# Altium schematic sheet clock.SchDoc: FastIC+ readout
size 297 x 209 mm; Organization: CERN; SheetNumber: 3; SheetTotal: 6; Projet: Fast Timing; ModifiedDate: -
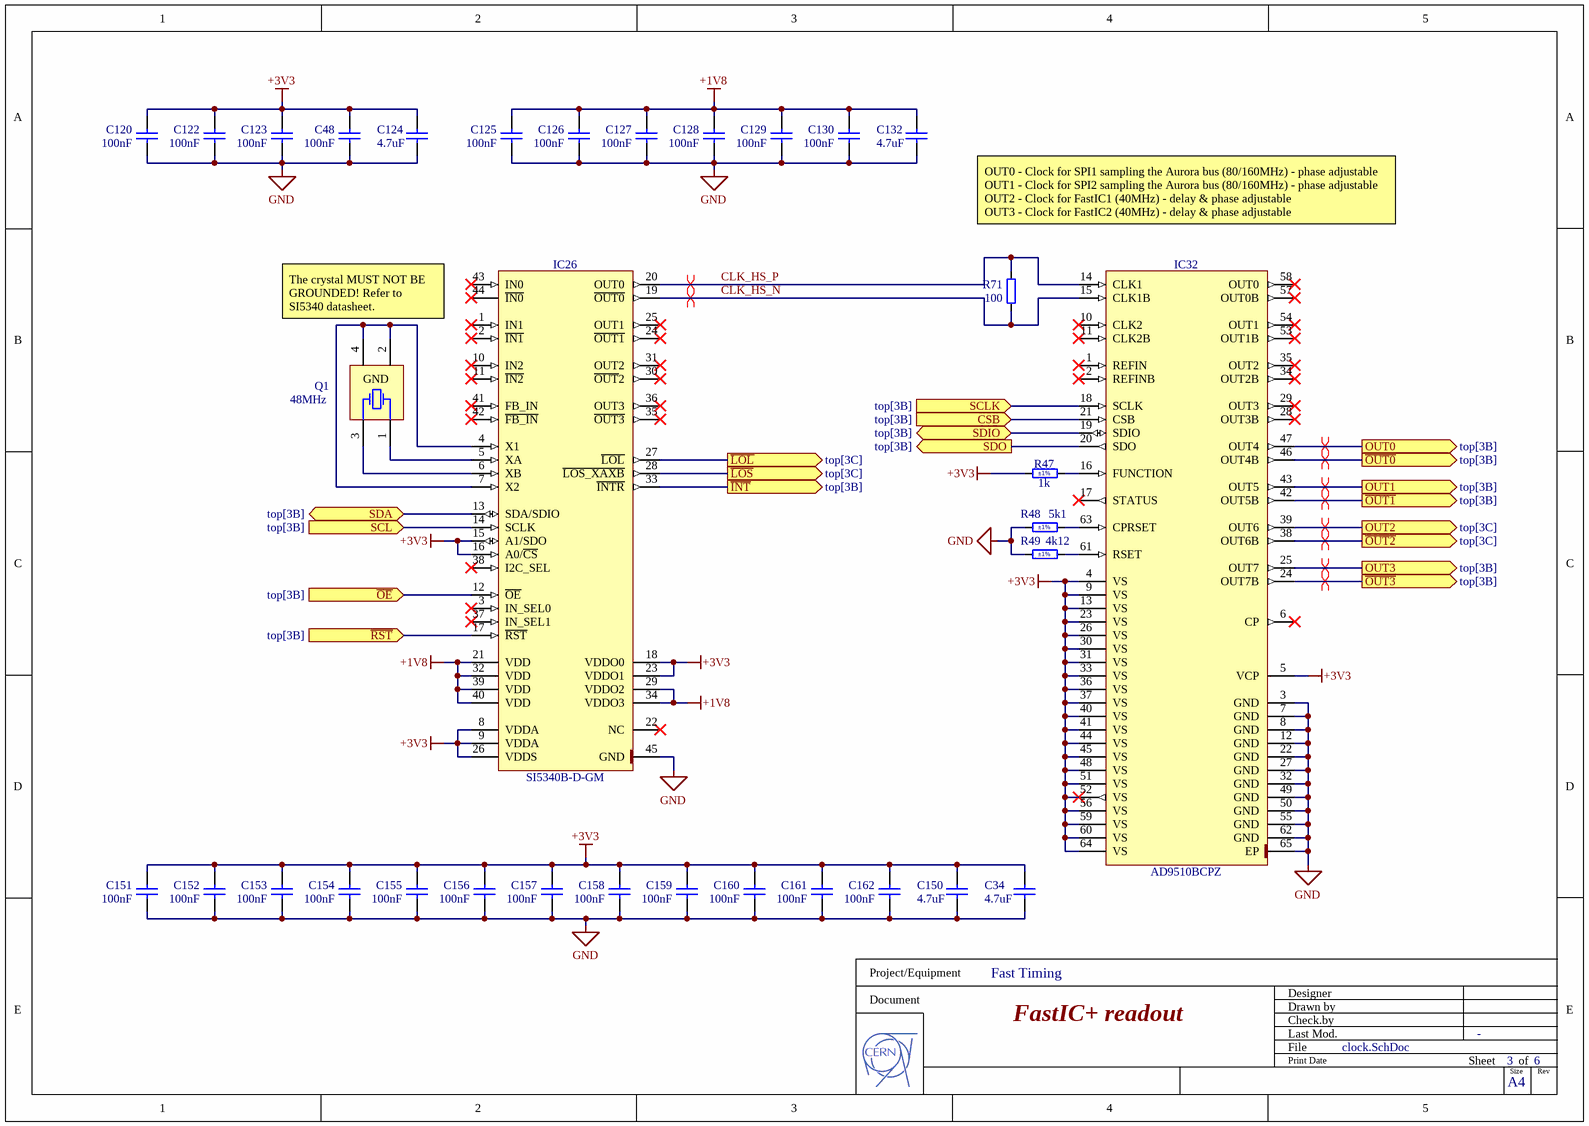
[diagram p0: clock.SchDoc]

## Parts
C34  4.7uF  [CAPC1608X87N]
C48  100nF  [CAPC1005X55N]
C120  100nF  [CAPC1005X55N]
C122  100nF  [CAPC1005X55N]
C123  100nF  [CAPC1005X55N]
C124  4.7uF  [CAPC1608X87N]
C125  100nF  [CAPC1005X55N]
C126  100nF  [CAPC1005X55N]
C127  100nF  [CAPC1005X55N]
C128  100nF  [CAPC1005X55N]
C129  100nF  [CAPC1005X55N]
C130  100nF  [CAPC1005X55N]
C132  4.7uF  [CAPC1608X87N]
C150  4.7uF  [CAPC1608X87N]
C151  100nF  [CAPC1005X55N]
C152  100nF  [CAPC1005X55N]
C153  100nF  [CAPC1005X55N]
C154  100nF  [CAPC1005X55N]
C155  100nF  [CAPC1005X55N]
C156  100nF  [CAPC1005X55N]
C157  100nF  [CAPC1005X55N]
C158  100nF  [CAPC1005X55N]
C159  100nF  [CAPC1005X55N]
C160  100nF  [CAPC1005X55N]
C161  100nF  [CAPC1005X55N]
C162  100nF  [CAPC1005X55N]
IC26  SI5340B-D-GM  [QFN50P700X700X90-45N-S530]
IC32  AD9510BCPZ  [QFN50P900X900X100-65N-S485]
Q1  48MHz  [XTAL_KYOCERA_CX3225SB]
R47  1k  Tolerance: ±1%  [RESC1005X40N]
R48  5k1  Tolerance: ±1%  [RESC1005X40N]
R49  4k12  Tolerance: ±1%  [RESC1005X40N]
R71  100  [RESC1005X40N]

## Ports
CSB (in, see top[3B]), OUT0 (out, see top[3B]), OUT1 (out, see top[3B]), OUT2 (out, see top[3C]), OUT3 (out, see top[3B]), SCL (in, see top[3B]), SCLK (in, see top[3B]), SDA (bidir, see top[3B]), SDIO (bidir, see top[3B]), SDO (out, see top[3B]), ~{INT} (out, see top[3B]), ~{LOL} (out, see top[3C]), ~{LOS} (out, see top[3C]), ~{OE} (in, see top[3B]), ~{OUT0} (out, see top[3B]), ~{OUT1} (out, see top[3B]), ~{OUT2} (out, see top[3C]), ~{OUT3} (out, see top[3B]), ~{RST} (in, see top[3B])

## Nets
+1V8: C125.2 C126.2 C127.2 C128.2 C129.2 C130.2 C132.1 IC26.21(VDD) IC26.29(VDDO2) IC26.32(VDD) IC26.34(VDDO3) IC26.39(VDD) IC26.40(VDD)
+3V3: C34.1 C48.2 C120.2 C122.2 C123.2 C124.1 C150.1 C151.2 C152.2 C153.2 C154.2 C155.2 C156.2 C157.2 C158.2 C159.2 C160.2 C161.2 C162.2 IC26.8(VDDA) IC26.9(VDDA) IC26.15(A1/SDO) IC26.16(A0/~{CS}) IC26.18(VDDO0) IC26.23(VDDO1) IC26.26(VDDS) IC32.4(VS) IC32.5(VCP) IC32.9(VS) IC32.13(VS) IC32.23(VS) IC32.26(VS) IC32.30(VS) IC32.31(VS) IC32.33(VS) IC32.36(VS) IC32.37(VS) IC32.40(VS) IC32.41(VS) IC32.44(VS) IC32.45(VS) IC32.48(VS) IC32.51(VS) IC32.52(VS) IC32.56(VS) IC32.59(VS) IC32.60(VS) IC32.64(VS) R47.1
GND: C34.2 C48.1 C120.1 C122.1 C123.1 C124.2 C125.1 C126.1 C127.1 C128.1 C129.1 C130.1 C132.2 C150.2 C151.1 C152.1 C153.1 C154.1 C155.1 C156.1 C157.1 C158.1 C159.1 C160.1 C161.1 C162.1 IC26.45(GND) IC32.3(GND) IC32.7(GND) IC32.8(GND) IC32.12(GND) IC32.22(GND) IC32.27(GND) IC32.32(GND) IC32.49(GND) IC32.50(GND) IC32.55(GND) IC32.62(GND) IC32.65(EP) R48.1 R49.1
CLK_HS_N: IC26.19(~{OUT0}) IC32.15(CLK1B) R71.2
CLK_HS_P: IC26.20(OUT0) IC32.14(CLK1) R71.1
CSB: IC32.21(CSB) ; port CSB
~{INT}: IC26.33(~{INTR}) ; port ~{INT}
~{LOL}: IC26.27(~{LOL}) ; port ~{LOL}
~{LOS}: IC26.28(~{LOS_XAXB}) ; port ~{LOS}
~{OE}: IC26.12(~{OE}) ; port ~{OE}
~{OUT0}: IC32.46(OUT4B) ; port ~{OUT0}
~{OUT1}: IC32.42(OUT5B) ; port ~{OUT1}
~{OUT2}: IC32.38(OUT6B) ; port ~{OUT2}
~{OUT3}: IC32.24(OUT7B) ; port ~{OUT3}
OUT0: IC32.47(OUT4) ; port OUT0
OUT1: IC32.43(OUT5) ; port OUT1
OUT2: IC32.39(OUT6) ; port OUT2
OUT3: IC32.25(OUT7) ; port OUT3
~{RST}: IC26.17(~{RST}) ; port ~{RST}
SCL: IC26.14(SCLK) ; port SCL
SCLK: IC32.18(SCLK) ; port SCLK
SDA: IC26.13(SDA/SDIO) ; port SDA
SDIO: IC32.19(SDIO) ; port SDIO
SDO: IC32.20(SDO) ; port SDO
NetIC26_4: IC26.4(X1) IC26.7(X2) Q1.2(GND) Q1.4(GND)
NetIC26_5: IC26.5(XA) Q1.1(X)
NetIC26_6: IC26.6(XB) Q1.3(X)
NetIC32_16: IC32.16(FUNCTION) R47.2
NetIC32_61: IC32.61(RSET) R49.2
NetIC32_63: IC32.63(CPRSET) R48.2

Not connected (* = marked no-connect by the designer): IC26 1(IN1)* 2(~{IN1})* 3(IN_SEL0)* 10(IN2)* 11(~{IN2})* 22(NC)* 24(~{OUT1})* 25(OUT1)* 30(~{OUT}2)* 31(OUT2)* 35(~{OUT3})* 36(OUT3)* 37(IN_SEL1)* 38(I2C_SEL)* 41(FB_IN)* 42(~{FB_IN})* 43(IN0)* 44(~{IN0})*; IC32 1(REFIN)* 2(REFINB)* 6(CP)* 10(CLK2)* 11(CLK2B)* 17(STATUS)* 28(OUT3B)* 29(OUT3)* 34(OUT2B)* 35(OUT2)* 53(OUT1B)* 54(OUT1)* 57(OUT0B)* 58(OUT0)*

## Layout directives
differential pair: CLK_HS_N, CLK_HS_P, OUT0, OUT1, OUT2, OUT3, ~{OUT0}, ~{OUT1}, ~{OUT2}, ~{OUT3}

## Notes on the sheet
- OUT0 - Clock for SPI1 sampling the Aurora bus (80/160MHz) - phase adjustable
  OUT1 - Clock for SPI2 sampling the Aurora bus (80/160MHz) - phase adjustable
  OUT2 - Clock for FastIC1 (40MHz) - delay & phase adjustable
  OUT3 - Clock for FastIC2 (40MHz) - delay & phase adjustable
- The crystal MUST NOT BE GROUNDED! Refer to SI5340 datasheet.
- Project/Equipment
- Document
- Designer
- Drawn by
- Check.by
- File
- Last Mod.
- Print Date
- Sheet
- Size
- A4
- of
- Rev

## Library data of the parts
C34 C124 C132 C150 = CC0603_4.7UF_6.3V_10%_X5R: Non-polarised capacitor; Part Description: SMD Multilayer Chip Ceramic Capacitor; Manufacturer: GENERIC; Manufacturer1 Part Number: 225520613672; Voltage: 6.3V; TC: X5R; Tolerance: ±10%; Part Number: CC0603_4.7UF_6.3V_10%_X5R; Component Kind: Standard; Component Type: Standard; Pin Count: 2; Value: 4.7uF; Status: Preferred; Manufacturer Part Number: CC0603_4.7UF_6.3V_10%_X5R; Case: 0603; Mounted: Yes; Socket: No; SMD: Yes; Sense: No; Manufacturer1 Example: PHYCOMP; Manufacturer1 ComponentHeight: 0.87mm; HelpURL: \\cern.ch\dfs\Applications\Altium\Datasheets\CC0805_X5R_PHYCOMP_HC.pdf; Author: CERN DEM JLC; CreateDate: 03/12/2007; LatestRevisionDate: 03/12/2007
C48 C120 C122 C123 C125-C130 C151-C162 = CC0402_100NF_16V_10%_X7R: Non-polarised capacitor; Part Description: SMD Multilayer Chip Ceramic Capacitor; Manufacturer: GENERIC; Manufacturer1 Part Number: GRM155R71C104KA88D; Voltage: 16V; TC: X7R; Tolerance: ±10%; Part Number: CC0402_100NF_16V_10%_X7R; Component Kind: Standard; Component Type: Standard; Pin Count: 2; Value: 100nF; Status: Not Recommended; Manufacturer Part Number: CC0402_100NF_16V_10%_X7R; Case: 0402; Mounted: Yes; Socket: No; SMD: Yes; Sense: No; Manufacturer1 Example: MURATA; Manufacturer1 ComponentHeight: 0.55mm; HelpURL: \\cern.ch\dfs\Applications\Altium\Datasheets\CC0402_X7R_MURATA_GRM.pdf; Author: CERN DEM JLC; CreateDate: 05/12/2013; LatestRevisionDate: 03/12/2007
IC26 = SI5340B-D-GM: Low-Jitter, 4-Output, Any-Frequency, Any-Output Clock Generator; Manufacturer: SILICON LABS; PressFit: No; Bonding: No; Part Number: SI5340B-D-GM; Component Kind: Standard; Component Type: Standard; Device: SI5340B-D-GM; PackageDescription: QFN, 0.50mm Pitch, Square; 44 Pin, 7.00mm L X 7.00mm W X 0.90mm H body (w/Thermal Tab 5.30 X 5.30mm), IPC Medium Density; Part Description: Low-Jitter, 4-Output, Any-Frequency, Any-Output Clock Generator; Manufacturer Part Number: SI5340B-D-GM; Pin Count: 45; Case: QFN44; Mounted: Yes; Socket: No; SMD: Yes; Sense: No; ComponentHeight: 0.9mm; Author: CERN DEM JLC; HelpURL: \\cern.ch\dfs\Applications\Altium\Datasheets\SI5340B-D-GM.pdf; CreateDate: 12/14/2017; LatestRevisionDate: 12/14/2017
IC32 = AD9510BCPZ: 1.2 GHz Clock Distribution IC, PLL Core, Dividers, Delay Adjust, Eight Outputs; Manufacturer: ANALOG DEVICES; PressFit: No; Bonding: No; Part Number: AD9510BCPZ; Component Kind: Standard; Component Type: Standard; Device: AD9510BCPZ; PackageDescription: QFN, 0.50mm Pitch, Square; 64 Pin, 9.00mm L X 9.00mm W X 1.00mm H body (w/Thermal Tab 4.85 X 4.85mm), IPC Medium Density; Part Description: 1.2 GHz Clock Distribution IC, PLL Core, Dividers, Delay Adjust, Eight Outputs; Manufacturer Part Number: AD9510BCP; Pin Count: 65; Case: QFN64; Mounted: Yes; Socket: No; SMD: Yes; Sense: No; ComponentHeight: 1mm; HelpURL: \\cern.ch\dfs\Applications\Altium\Datasheets\AD9510BCPZ.pdf; Author: CERN DEM JLC; CreateDate: 10/9/2012; LatestRevisionDate: 3/29/2022
Q1 = XTAL_48MHZ_KYOCERA_CX3225SB48000D0FPJC1: Crystal 4 pins 1=XTAL Control 2=GND3=XTAL 4=GND; Part Description: Tolerance: ±10ppm, Stability: ±15ppm, 8pF, -40°C to +85°C, Surface Mount Crystal; PressFit: No; Bonding: No; Part Number: XTAL_48MHZ_KYOCERA_CX3225SB48000D0FPJC1; Component Kind: Standard; Component Type: Standard; PackageDescription: SMD Crystal Kyocera, 4 Pins, 2.50mm L X 3.20mm W X 0.6mm H; Value: 48MHz; Manufacturer: KYOCERA; Manufacturer Part Number: CX3225SB48000D0FPJC1; Pin Count: 4; Mounted: Yes; Socket: No; SMD: Yes; Sense: No; ComponentHeight: 0.6mm; HelpURL: \\cern.ch\dfs\Applications\Altium\Datasheets\XTAL_KYOCERA_CX3225SB.pdf; Author: CERN DEM JLC; CreateDate: 6/5/2018; LatestRevisionDate: 6/5/2018
R47 = R0402_1K_1%_0.0625W_100PPM: Resistor - 1%; Part Description: General Purpose Thick Film Chip Resistor; Manufacturer: GENERIC; Manufacturer1 Part Number: 232270671002L; TC: ±100ppm/°C; PressFit: No; Part Number: R0402_1K_1%_0.0625W_100PPM; Component Kind: Standard; Component Type: Standard; Pin Count: 2; Value: 1k; Status: Not Recommended; Power: 0.0625W; Manufacturer Part Number: R0402_1K_1%_0.0625W_100PPM; Case: 0402; Mounted: Yes; Sense: No; Socket: No; SMD: Yes; Manufacturer1 Example: YAGEO PHYCOMP; Manufacturer1 ComponentHeight: 0.4mm; HelpURL: \\cern.ch\dfs\Applications\Altium\Datasheets\R0402_Phycomp_RC0402.pdf; Author: CERN DEM JLC; CreateDate: 12/3/2007; LatestRevisionDate: 10/17/2012
R48 = R0402_5K1_1%_0.0625W_100PPM: Resistor - 1%; Part Description: General Purpose Thick Film Chip Resistor; Manufacturer: GENERIC; Manufacturer1 Part Number: 232270675102L; TC: ±100ppm/°C; PressFit: No; Part Number: R0402_5K1_1%_0.0625W_100PPM; Component Kind: Standard; Component Type: Standard; Pin Count: 2; Value: 5k1; Status: Not Recommended; Power: 0.0625W; Manufacturer Part Number: R0402_5K1_1%_0.0625W_100PPM; Case: 0402; Mounted: Yes; Sense: No; Socket: No; SMD: Yes; Manufacturer1 Example: YAGEO PHYCOMP; Manufacturer1 ComponentHeight: 0.4mm; HelpURL: \\cern.ch\dfs\Applications\Altium\Datasheets\R0402_Phycomp_RC0402.pdf; Author: CERN DEM JLC; CreateDate: 12/3/2007; LatestRevisionDate: 10/17/2012
R49 = R0402_4K12_1%_0.0625W_100PPM: Resistor - 1%; Part Description: General Purpose Thick Film Chip Resistor; Manufacturer: GENERIC; Manufacturer1 Part Number: 232270674122L or RC0402FR-074K12L; TC: ±100ppm/°C; PressFit: No; Part Number: R0402_4K12_1%_0.0625W_100PPM; Component Kind: Standard; Component Type: Standard; Pin Count: 2; Value: 4k12; Status: Not Recommended; Power: 0.0625W; Manufacturer Part Number: R0402_4K12_1%_0.0625W_100PPM; Case: 0402; Mounted: Yes; Sense: No; Socket: No; SMD: Yes; Manufacturer1 Example: YAGEO PHYCOMP; Manufacturer1 ComponentHeight: 0.4mm; HelpURL: \\cern.ch\dfs\Applications\Altium\Datasheets\R0402_Phycomp_RC0402.pdf; Author: CERN DEM JLC; CreateDate: 10/24/2012; LatestRevisionDate: 10/24/2012
R71 = R0402_100R_1%_0.1W_100PPM: Resistor - 1%; Part Description: General Purpose Thick Film Chip Resistor; Manufacturer: GENERIC; Manufacturer Part Number: R0402_100R_1%_0.1W_100PPM_50V; Manufacturer1 Part Number: ERJ2RKF1000X; Power: 0.1W; TC: ±100ppm/°C; PressFit: No; Voltage: 50V; Part Number: R0402_100R_1%_0.1W_100PPM; Component Kind: Standard; Component Type: Standard; Pin Count: 2; Value: 100; Status: Not Recommended; Tolerance: ±1%; Case: 0402; Mounted: Yes; Sense: No; Socket: No; SMD: Yes; Manufacturer1 Example: PANASONIC; Manufacturer1 ComponentHeight: 0.4mm; HelpURL: \\cern.ch\dfs\Applications\Altium\Datasheets\R0402_PANASONIC_ERJ2RK.pdf; Author: CERN DEM JLC; CreateDate: 12/12/2013; LatestRevisionDate: 03/03/2015